# EAGLE schematic SpeedOfLightController (EAGLE 9.5.1)

## Sheet 1 of 5
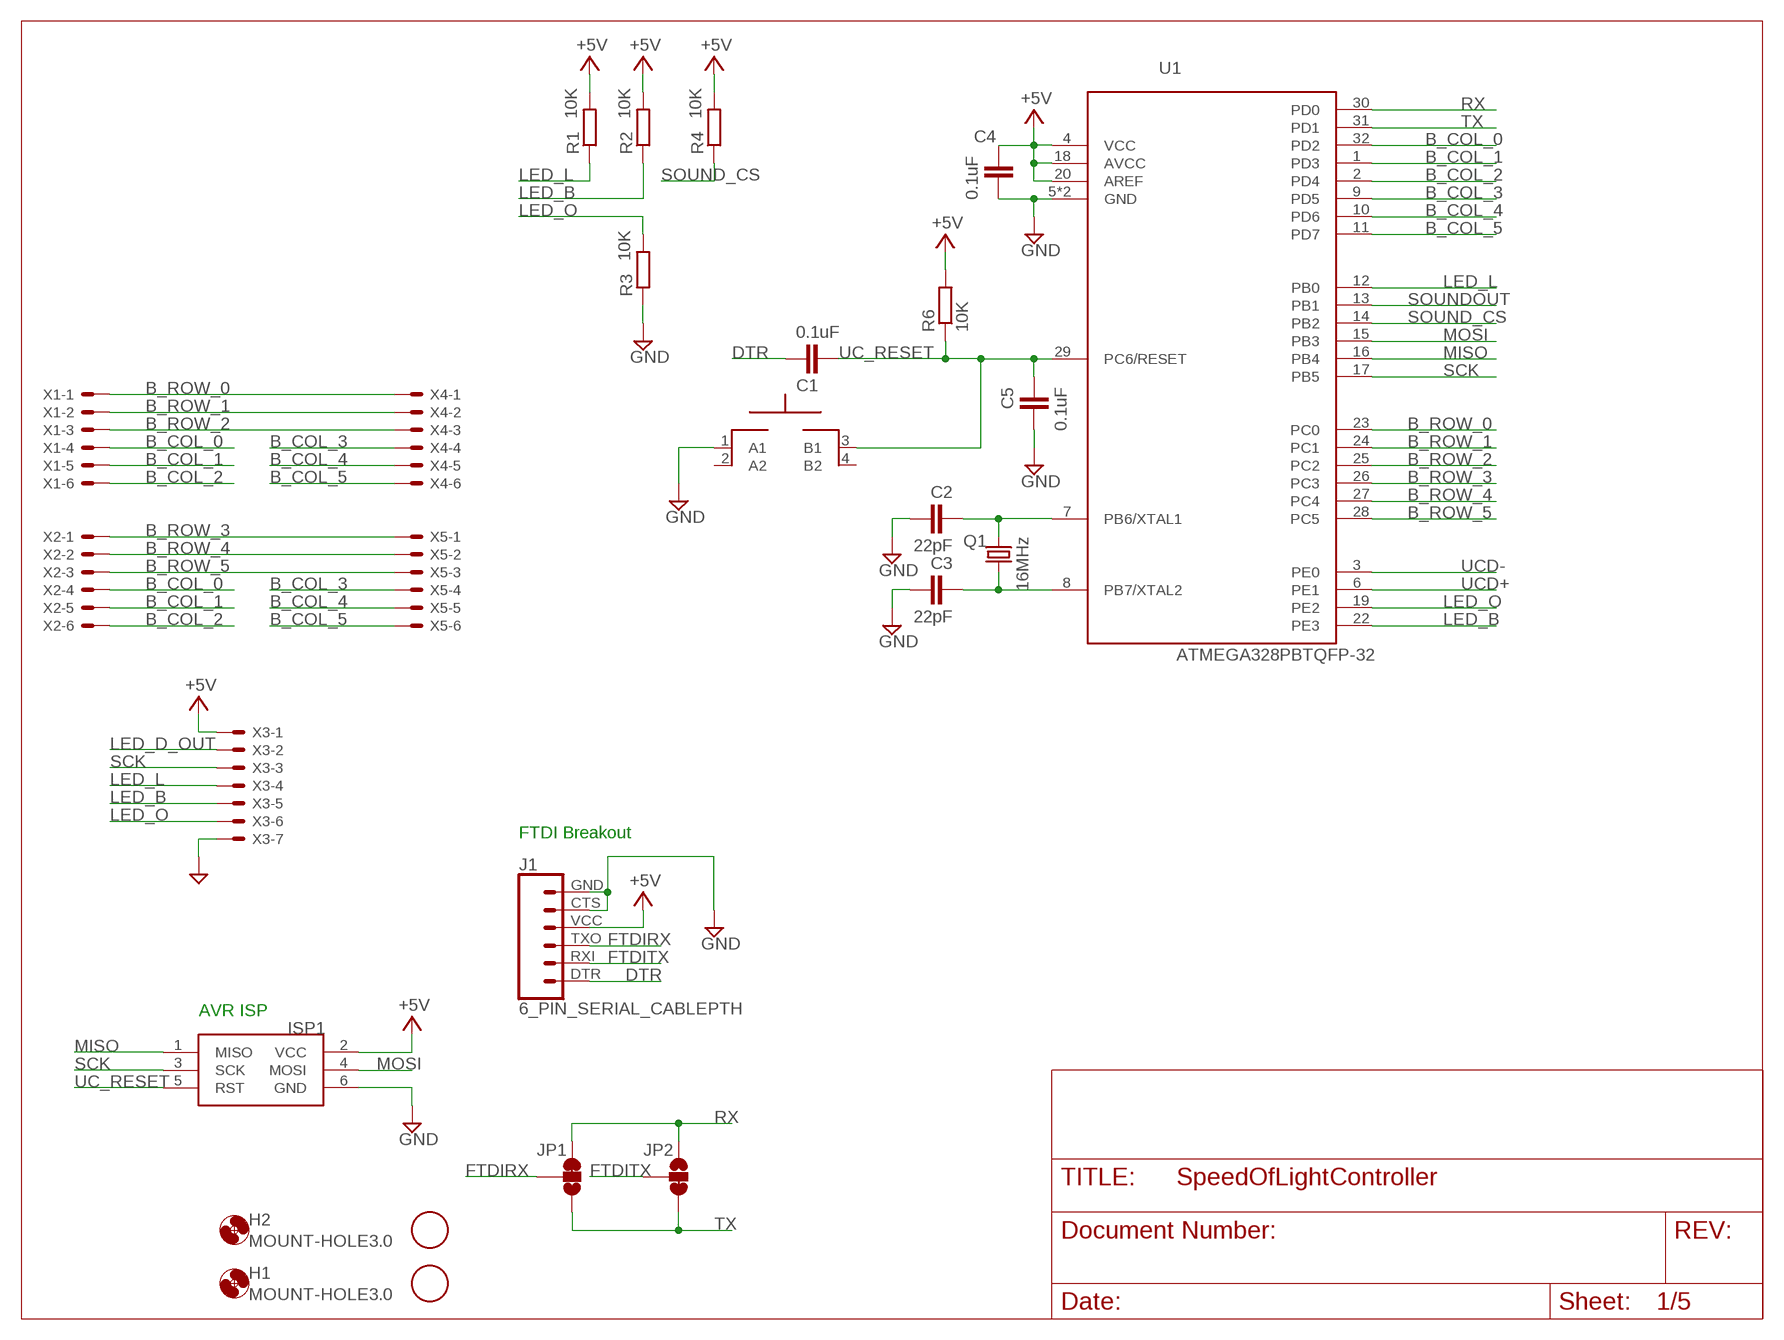
[diagram p0: schematic, sheet 1]

### Parts
C1  0.1uF  C-EUC0805  [C0805]
C2  22pF  C-EUC0805  [C0805]
C3  22pF  C-EUC0805  [C0805]
C4  0.1uF  C-EUC0805  [C0805]
C5  0.1uF  C-EUC0805  [C0805]
F1  FIDUCIAL  [FIDUCIAL_1MM]
F2  FIDUCIAL  [FIDUCIAL_1MM]
H1  MOUNT-HOLE3.0  [3,0]
H2  MOUNT-HOLE3.0  [3,0]
ISP1  AVRISP-6  [AVRISP]
J1  6_PIN_SERIAL_CABLEPTH  [FTDI_BASIC]
JP1  JUMPER-SMT_3_1-NC_TRACE_SILK  [SMT-JUMPER_3_1-NC_TRACE_SILK]
JP2  JUMPER-SMT_3_1-NC_TRACE_SILK  [SMT-JUMPER_3_1-NC_TRACE_SILK]
Q1  16MHz  CRYSTALHC49UP  [HC49UP]
R1  10K  R-EU_R0805  [R0805]
R2  10K  R-EU_R0805  [R0805]
R3  10K  R-EU_R0805  [R0805]
R4  10K  R-EU_R0805  [R0805]
R6  10K  R-EU_R0805  [R0805]
RESET  MOMENTARYBUTTON  [SPST_NO_SMD]
U1  ATMEGA328PBTQFP-32  [QFP80P900X900X120-32N]
X1  JST-XH-06-PIN-LONG-PAD  [JST-XH-06-PACKAGE-LONG-PAD]
X2  JST-XH-06-PIN-LONG-PAD  [JST-XH-06-PACKAGE-LONG-PAD]
X3  JST-XH-07-PIN-LONG-PAD  [JST-XH-07-PACKAGE-LONG-PAD]
X4  JST-XH-06-PIN-LONG-PAD  [JST-XH-06-PACKAGE-LONG-PAD]
X5  JST-XH-06-PIN-LONG-PAD  [JST-XH-06-PACKAGE-LONG-PAD]

### Nets
+5V: C4.2 ISP1.2(VCC) J1.VCC R1.2 R2.2 R4.2 R6.2 U1.4(VCC) U1.18(AVCC) U1.20(AREF) X3.1 ; also sheet 2,4,5
B_COL_0: U1.32(PD2) X1.4 X2.4
B_COL_1: U1.1(PD3) X1.5 X2.5
B_COL_2: U1.2(PD4) X1.6 X2.6
B_COL_3: U1.9(PD5) X4.4 X5.4
B_COL_4: U1.10(PD6) X4.5 X5.5
B_COL_5: U1.11(PD7) X4.6 X5.6
B_ROW_0: U1.23(PC0) X1.1 X4.1
B_ROW_1: U1.24(PC1) X1.2 X4.2
B_ROW_2: U1.25(PC2) X1.3 X4.3
B_ROW_3: U1.26(PC3) X2.1 X5.1
B_ROW_4: U1.27(PC4) X2.2 X5.2
B_ROW_5: U1.28(PC5) X2.3 X5.3
DTR: C1.2 J1.DTR
FTDIRX: J1.TXO JP1.2
FTDITX: J1.RXI JP2.2
GND: C2.1 C3.1 C4.1 C5.1 ISP1.6(GND) J1.CTS J1.GND R3.1 RESET.1(A1) U1.5(GND) U1.21(GND) X3.7 ; also sheet 2,3,4,5
LED_B: R2.1 U1.22(PE3) X3.5 ; also sheet 2
LED_D_OUT: X3.2 ; also sheet 2
LED_L: R1.1 U1.12(PB0) X3.4 ; also sheet 2
LED_O: R3.2 U1.19(PE2) X3.6 ; also sheet 2
MISO: ISP1.1(MISO) U1.16(PB4) ; also sheet 4
MOSI: ISP1.4(MOSI) U1.15(PB3) ; also sheet 2,4
N$17: C2.2 Q1.1 U1.7(PB6/XTAL1)
N$18: C3.2 Q1.2 U1.8(PB7/XTAL2)
RX: JP1.3 JP2.1 U1.30(PD0)
SCK: ISP1.3(SCK) U1.17(PB5) X3.3 ; also sheet 2,4
SOUND_CS: R4.1 U1.14(PB2) ; also sheet 4
SOUNDOUT: U1.13(PB1) ; also sheet 4
TX: JP1.1 JP2.3 U1.31(PD1)
UC_RESET: C1.1 C5.2 ISP1.5(RST) R6.1 RESET.3(B1) U1.29(PC6/RESET)
UCD+: U1.6(PE1) ; also sheet 5
UCD-: U1.3(PE0) ; also sheet 5
Unconnected: RESET.2(A2) RESET.4(B2)

### Notes on the sheet
- FTDI Breakout
- AVR ISP

## Sheet 2 of 5: ScoreBoard
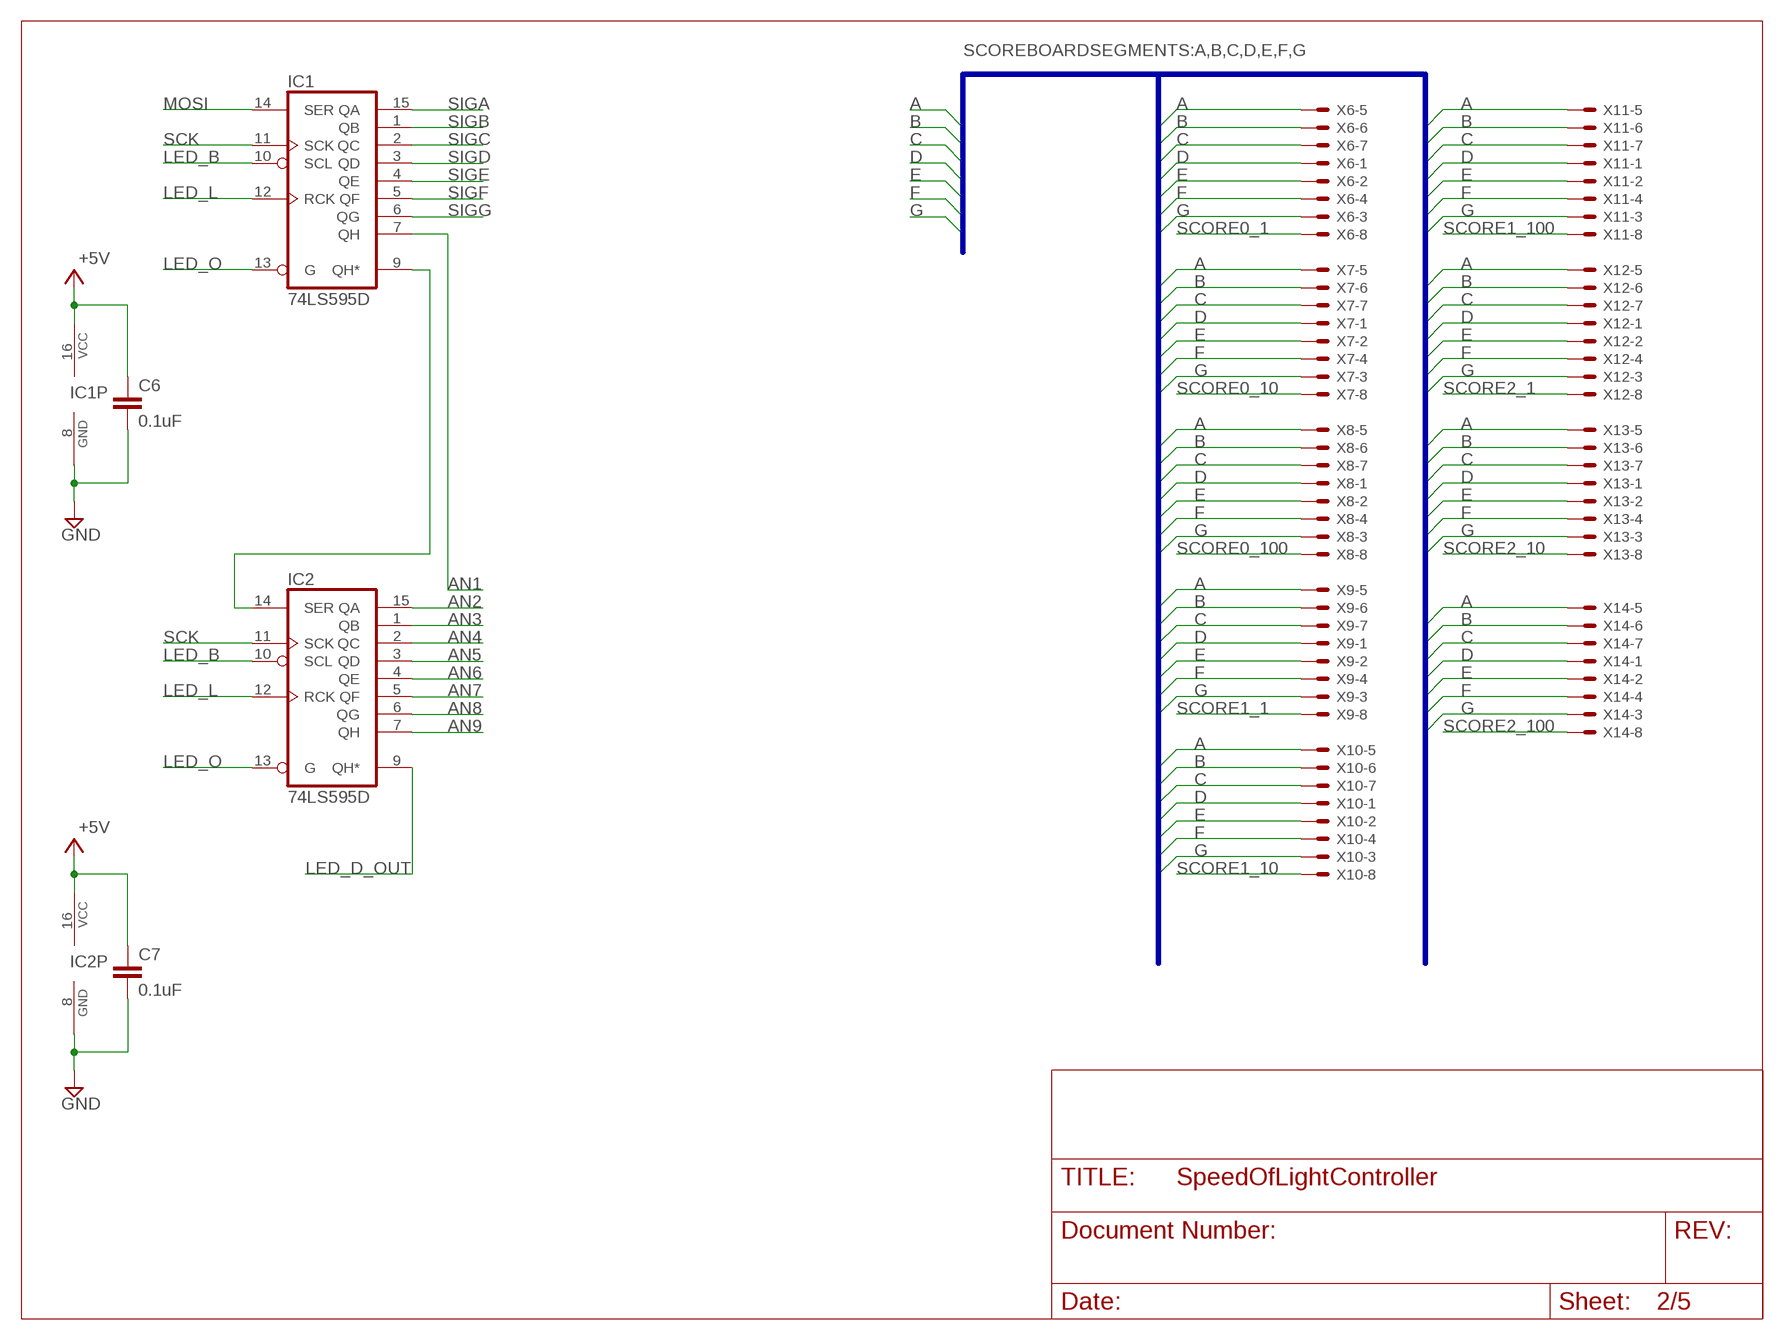
[diagram p1: schematic, sheet 2]

### Parts
C6  0.1uF  C-EUC0805  [C0805]
C7  0.1uF  C-EUC0805  [C0805]
IC1  74LS595D  [SO16]
IC2  74LS595D  [SO16]
X6  JST-XH-08-PIN-LONG-PAD  [JST-XH-08-PACKAGE-LONG-PAD]
X7  JST-XH-08-PIN-LONG-PAD  [JST-XH-08-PACKAGE-LONG-PAD]
X8  JST-XH-08-PIN-LONG-PAD  [JST-XH-08-PACKAGE-LONG-PAD]
X9  JST-XH-08-PIN-LONG-PAD  [JST-XH-08-PACKAGE-LONG-PAD]
X10  JST-XH-08-PIN-LONG-PAD  [JST-XH-08-PACKAGE-LONG-PAD]
X11  JST-XH-08-PIN-LONG-PAD  [JST-XH-08-PACKAGE-LONG-PAD]
X12  JST-XH-08-PIN-LONG-PAD  [JST-XH-08-PACKAGE-LONG-PAD]
X13  JST-XH-08-PIN-LONG-PAD  [JST-XH-08-PACKAGE-LONG-PAD]
X14  JST-XH-08-PIN-LONG-PAD  [JST-XH-08-PACKAGE-LONG-PAD]

### Nets
+5V: C6.1 C7.1 IC1.16(VCC) IC2.16(VCC) ; also sheet 1,4,5
A: X6.5 X7.5 X8.5 X9.5 X10.5 X11.5 X12.5 X13.5 X14.5 ; also sheet 3
AN1: IC1.7(QH) ; also sheet 3
AN2: IC2.15(QA) ; also sheet 3
AN3: IC2.1(QB) ; also sheet 3
AN4: IC2.2(QC) ; also sheet 3
AN5: IC2.3(QD) ; also sheet 3
AN6: IC2.4(QE) ; also sheet 3
AN7: IC2.5(QF) ; also sheet 3
AN8: IC2.6(QG) ; also sheet 3
AN9: IC2.7(QH) ; also sheet 3
B: X6.6 X7.6 X8.6 X9.6 X10.6 X11.6 X12.6 X13.6 X14.6 ; also sheet 3
C: X6.7 X7.7 X8.7 X9.7 X10.7 X11.7 X12.7 X13.7 X14.7 ; also sheet 3
D: X6.1 X7.1 X8.1 X9.1 X10.1 X11.1 X12.1 X13.1 X14.1 ; also sheet 3
E: X6.2 X7.2 X8.2 X9.2 X10.2 X11.2 X12.2 X13.2 X14.2 ; also sheet 3
F: X6.4 X7.4 X8.4 X9.4 X10.4 X11.4 X12.4 X13.4 X14.4 ; also sheet 3
G: X6.3 X7.3 X8.3 X9.3 X10.3 X11.3 X12.3 X13.3 X14.3 ; also sheet 3
GND: C6.2 C7.2 IC1.8(GND) IC2.8(GND) ; also sheet 1,3,4,5
LED_B: IC1.10(SCL) IC2.10(SCL) ; also sheet 1
LED_D_OUT: IC2.9(QH*) ; also sheet 1
LED_L: IC1.12(RCK) IC2.12(RCK) ; also sheet 1
LED_O: IC1.13(G) IC2.13(G) ; also sheet 1
MOSI: IC1.14(SER) ; also sheet 1,4
N$39: IC1.9(QH*) IC2.14(SER)
SCK: IC1.11(SCK) IC2.11(SCK) ; also sheet 1,4
SCORE0_1: X6.8 ; also sheet 3
SCORE0_10: X7.8 ; also sheet 3
SCORE0_100: X8.8 ; also sheet 3
SCORE1_1: X9.8 ; also sheet 3
SCORE1_10: X10.8 ; also sheet 3
SCORE1_100: X11.8 ; also sheet 3
SCORE2_1: X12.8 ; also sheet 3
SCORE2_10: X13.8 ; also sheet 3
SCORE2_100: X14.8 ; also sheet 3
SIGA: IC1.15(QA) ; also sheet 3
SIGB: IC1.1(QB) ; also sheet 3
SIGC: IC1.2(QC) ; also sheet 3
SIGD: IC1.3(QD) ; also sheet 3
SIGE: IC1.4(QE) ; also sheet 3
SIGF: IC1.5(QF) ; also sheet 3
SIGG: IC1.6(QG) ; also sheet 3

### Buses
SCOREBOARDSEGMENTS:A,B,C,D,E,F,G

## Sheet 3 of 5: Scoreboard switches
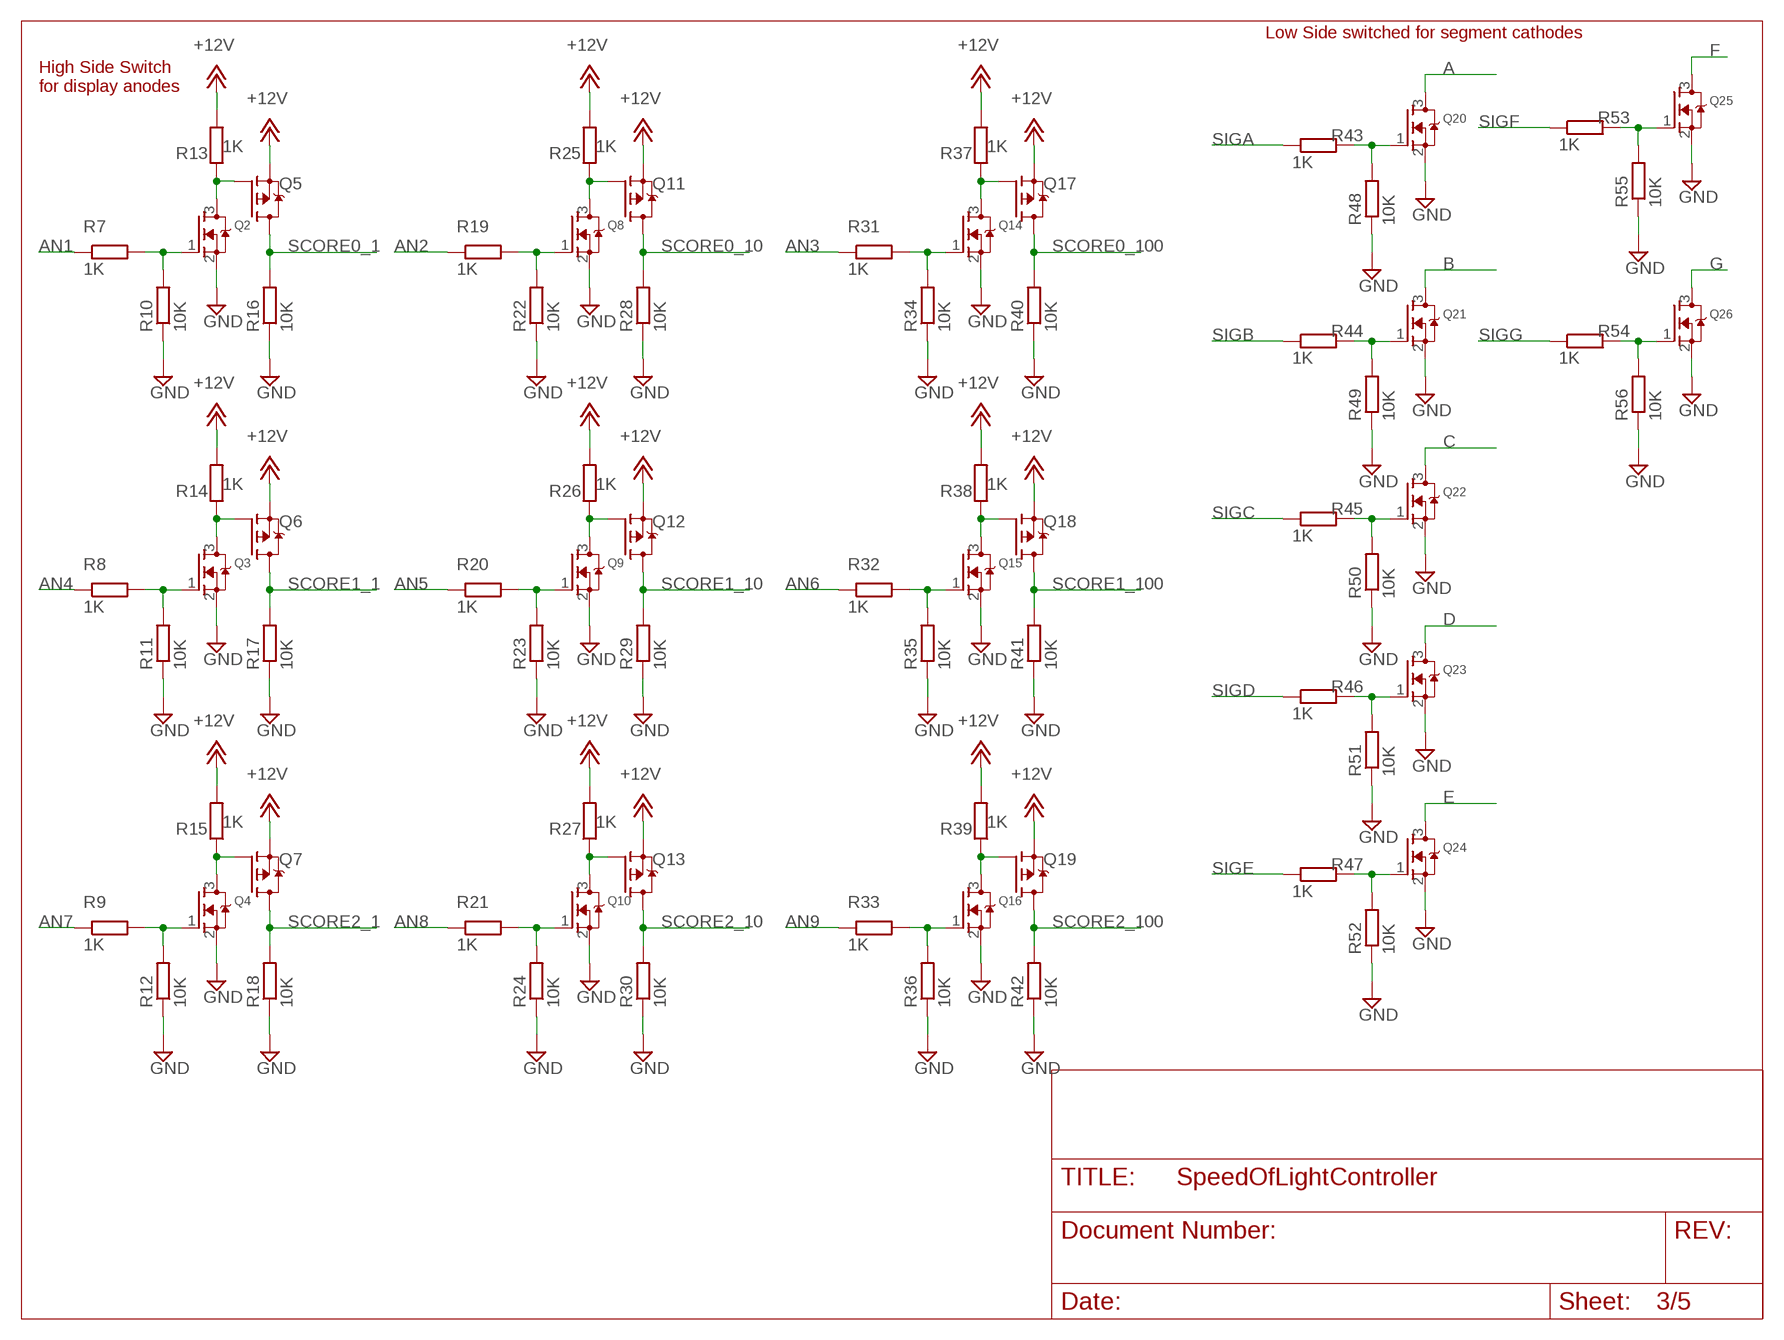
[diagram p2: schematic, sheet 3]

### Parts
Q2  AO3414SOT23  [SOT95P240X110-3N]
Q3  AO3414SOT23  [SOT95P240X110-3N]
Q4  AO3414SOT23  [SOT95P240X110-3N]
Q5  AO3415  [SOT95P240X110-3N]
Q6  AO3415  [SOT95P240X110-3N]
Q7  AO3415  [SOT95P240X110-3N]
Q8  AO3414SOT23  [SOT95P240X110-3N]
Q9  AO3414SOT23  [SOT95P240X110-3N]
Q10  AO3414SOT23  [SOT95P240X110-3N]
Q11  AO3415  [SOT95P240X110-3N]
Q12  AO3415  [SOT95P240X110-3N]
Q13  AO3415  [SOT95P240X110-3N]
Q14  AO3414SOT23  [SOT95P240X110-3N]
Q15  AO3414SOT23  [SOT95P240X110-3N]
Q16  AO3414SOT23  [SOT95P240X110-3N]
Q17  AO3415  [SOT95P240X110-3N]
Q18  AO3415  [SOT95P240X110-3N]
Q19  AO3415  [SOT95P240X110-3N]
Q20  AO3414SOT23  [SOT95P240X110-3N]
Q21  AO3414SOT23  [SOT95P240X110-3N]
Q22  AO3414SOT23  [SOT95P240X110-3N]
Q23  AO3414SOT23  [SOT95P240X110-3N]
Q24  AO3414SOT23  [SOT95P240X110-3N]
Q25  AO3414SOT23  [SOT95P240X110-3N]
Q26  AO3414SOT23  [SOT95P240X110-3N]
R7  1K  R-EU_R0805  [R0805]
R8  1K  R-EU_R0805  [R0805]
R9  1K  R-EU_R0805  [R0805]
R10  10K  R-EU_R0805  [R0805]
R11  10K  R-EU_R0805  [R0805]
R12  10K  R-EU_R0805  [R0805]
R13  1K  R-EU_R0805  [R0805]
R14  1K  R-EU_R0805  [R0805]
R15  1K  R-EU_R0805  [R0805]
R16  10K  R-EU_R0805  [R0805]
R17  10K  R-EU_R0805  [R0805]
R18  10K  R-EU_R0805  [R0805]
R19  1K  R-EU_R0805  [R0805]
R20  1K  R-EU_R0805  [R0805]
R21  1K  R-EU_R0805  [R0805]
R22  10K  R-EU_R0805  [R0805]
R23  10K  R-EU_R0805  [R0805]
R24  10K  R-EU_R0805  [R0805]
R25  1K  R-EU_R0805  [R0805]
R26  1K  R-EU_R0805  [R0805]
R27  1K  R-EU_R0805  [R0805]
R28  10K  R-EU_R0805  [R0805]
R29  10K  R-EU_R0805  [R0805]
R30  10K  R-EU_R0805  [R0805]
R31  1K  R-EU_R0805  [R0805]
R32  1K  R-EU_R0805  [R0805]
R33  1K  R-EU_R0805  [R0805]
R34  10K  R-EU_R0805  [R0805]
R35  10K  R-EU_R0805  [R0805]
R36  10K  R-EU_R0805  [R0805]
R37  1K  R-EU_R0805  [R0805]
R38  1K  R-EU_R0805  [R0805]
R39  1K  R-EU_R0805  [R0805]
R40  10K  R-EU_R0805  [R0805]
R41  10K  R-EU_R0805  [R0805]
R42  10K  R-EU_R0805  [R0805]
R43  1K  R-EU_R0805  [R0805]
R44  1K  R-EU_R0805  [R0805]
R45  1K  R-EU_R0805  [R0805]
R46  1K  R-EU_R0805  [R0805]
R47  1K  R-EU_R0805  [R0805]
R48  10K  R-EU_R0805  [R0805]
R49  10K  R-EU_R0805  [R0805]
R50  10K  R-EU_R0805  [R0805]
R51  10K  R-EU_R0805  [R0805]
R52  10K  R-EU_R0805  [R0805]
R53  1K  R-EU_R0805  [R0805]
R54  1K  R-EU_R0805  [R0805]
R55  10K  R-EU_R0805  [R0805]
R56  10K  R-EU_R0805  [R0805]

### Nets
+12V [power]: Q5.2(S) Q6.2(S) Q7.2(S) Q11.2(S) Q12.2(S) Q13.2(S) Q17.2(S) Q18.2(S) Q19.2(S) R13.2 R14.2 R15.2 R25.2 R26.2 R27.2 R37.2 R38.2 R39.2 ; also sheet 5
A: Q20.3(D) ; also sheet 2
AN1: R7.1 ; also sheet 2
AN2: R19.1 ; also sheet 2
AN3: R31.1 ; also sheet 2
AN4: R8.1 ; also sheet 2
AN5: R20.1 ; also sheet 2
AN6: R32.1 ; also sheet 2
AN7: R9.1 ; also sheet 2
AN8: R21.1 ; also sheet 2
AN9: R33.1 ; also sheet 2
B: Q21.3(D) ; also sheet 2
C: Q22.3(D) ; also sheet 2
D: Q23.3(D) ; also sheet 2
E: Q24.3(D) ; also sheet 2
F: Q25.3(D) ; also sheet 2
G: Q26.3(D) ; also sheet 2
GND: Q2.2(S) Q3.2(S) Q4.2(S) Q8.2(S) Q9.2(S) Q10.2(S) Q14.2(S) Q15.2(S) Q16.2(S) Q20.2(S) Q21.2(S) Q22.2(S) Q23.2(S) Q24.2(S) Q25.2(S) Q26.2(S) R10.1 R11.1 R12.1 R16.1 R17.1 R18.1 R22.1 R23.1 R24.1 R28.1 R29.1 R30.1 R34.1 R35.1 R36.1 R40.1 R41.1 R42.1 R48.1 R49.1 R50.1 R51.1 R52.1 R55.1 R56.1 ; also sheet 1,2,4,5
N$1: Q21.1(G) R44.2 R49.2
N$2: Q22.1(G) R45.2 R50.2
N$3: Q23.1(G) R46.2 R51.2
N$4: Q24.1(G) R47.2 R52.2
N$5: Q20.1(G) R43.2 R48.2
N$6: Q25.1(G) R53.2 R55.2
N$7: Q26.1(G) R54.2 R56.2
N$8: Q2.1(G) R7.2 R10.2
N$9: Q8.1(G) R19.2 R22.2
N$10: Q14.1(G) R31.2 R34.2
N$11: Q3.1(G) R8.2 R11.2
N$12: Q9.1(G) R20.2 R23.2
N$13: Q15.1(G) R32.2 R35.2
N$14: Q4.1(G) R9.2 R12.2
N$15: Q10.1(G) R21.2 R24.2
N$16: Q16.1(G) R33.2 R36.2
N$27: Q16.3(D) Q19.1(G) R39.1
N$28: Q10.3(D) Q13.1(G) R27.1
N$29: Q4.3(D) Q7.1(G) R15.1
N$30: Q3.3(D) Q6.1(G) R14.1
N$34: Q9.3(D) Q12.1(G) R26.1
N$35: Q15.3(D) Q18.1(G) R38.1
N$36: Q14.3(D) Q17.1(G) R37.1
N$37: Q8.3(D) Q11.1(G) R25.1
N$38: Q2.3(D) Q5.1(G) R13.1
SCORE0_1: Q5.3(D) R16.2 ; also sheet 2
SCORE0_10: Q11.3(D) R28.2 ; also sheet 2
SCORE0_100: Q17.3(D) R40.2 ; also sheet 2
SCORE1_1: Q6.3(D) R17.2 ; also sheet 2
SCORE1_10: Q12.3(D) R29.2 ; also sheet 2
SCORE1_100: Q18.3(D) R41.2 ; also sheet 2
SCORE2_1: Q7.3(D) R18.2 ; also sheet 2
SCORE2_10: Q13.3(D) R30.2 ; also sheet 2
SCORE2_100: Q19.3(D) R42.2 ; also sheet 2
SIGA: R43.1 ; also sheet 2
SIGB: R44.1 ; also sheet 2
SIGC: R45.1 ; also sheet 2
SIGD: R46.1 ; also sheet 2
SIGE: R47.1 ; also sheet 2
SIGF: R53.1 ; also sheet 2
SIGG: R54.1 ; also sheet 2

### Notes on the sheet
- Low Side switched for segment cathodes
- High Side Switch 
  for display anodes

## Sheet 4 of 5: Sound
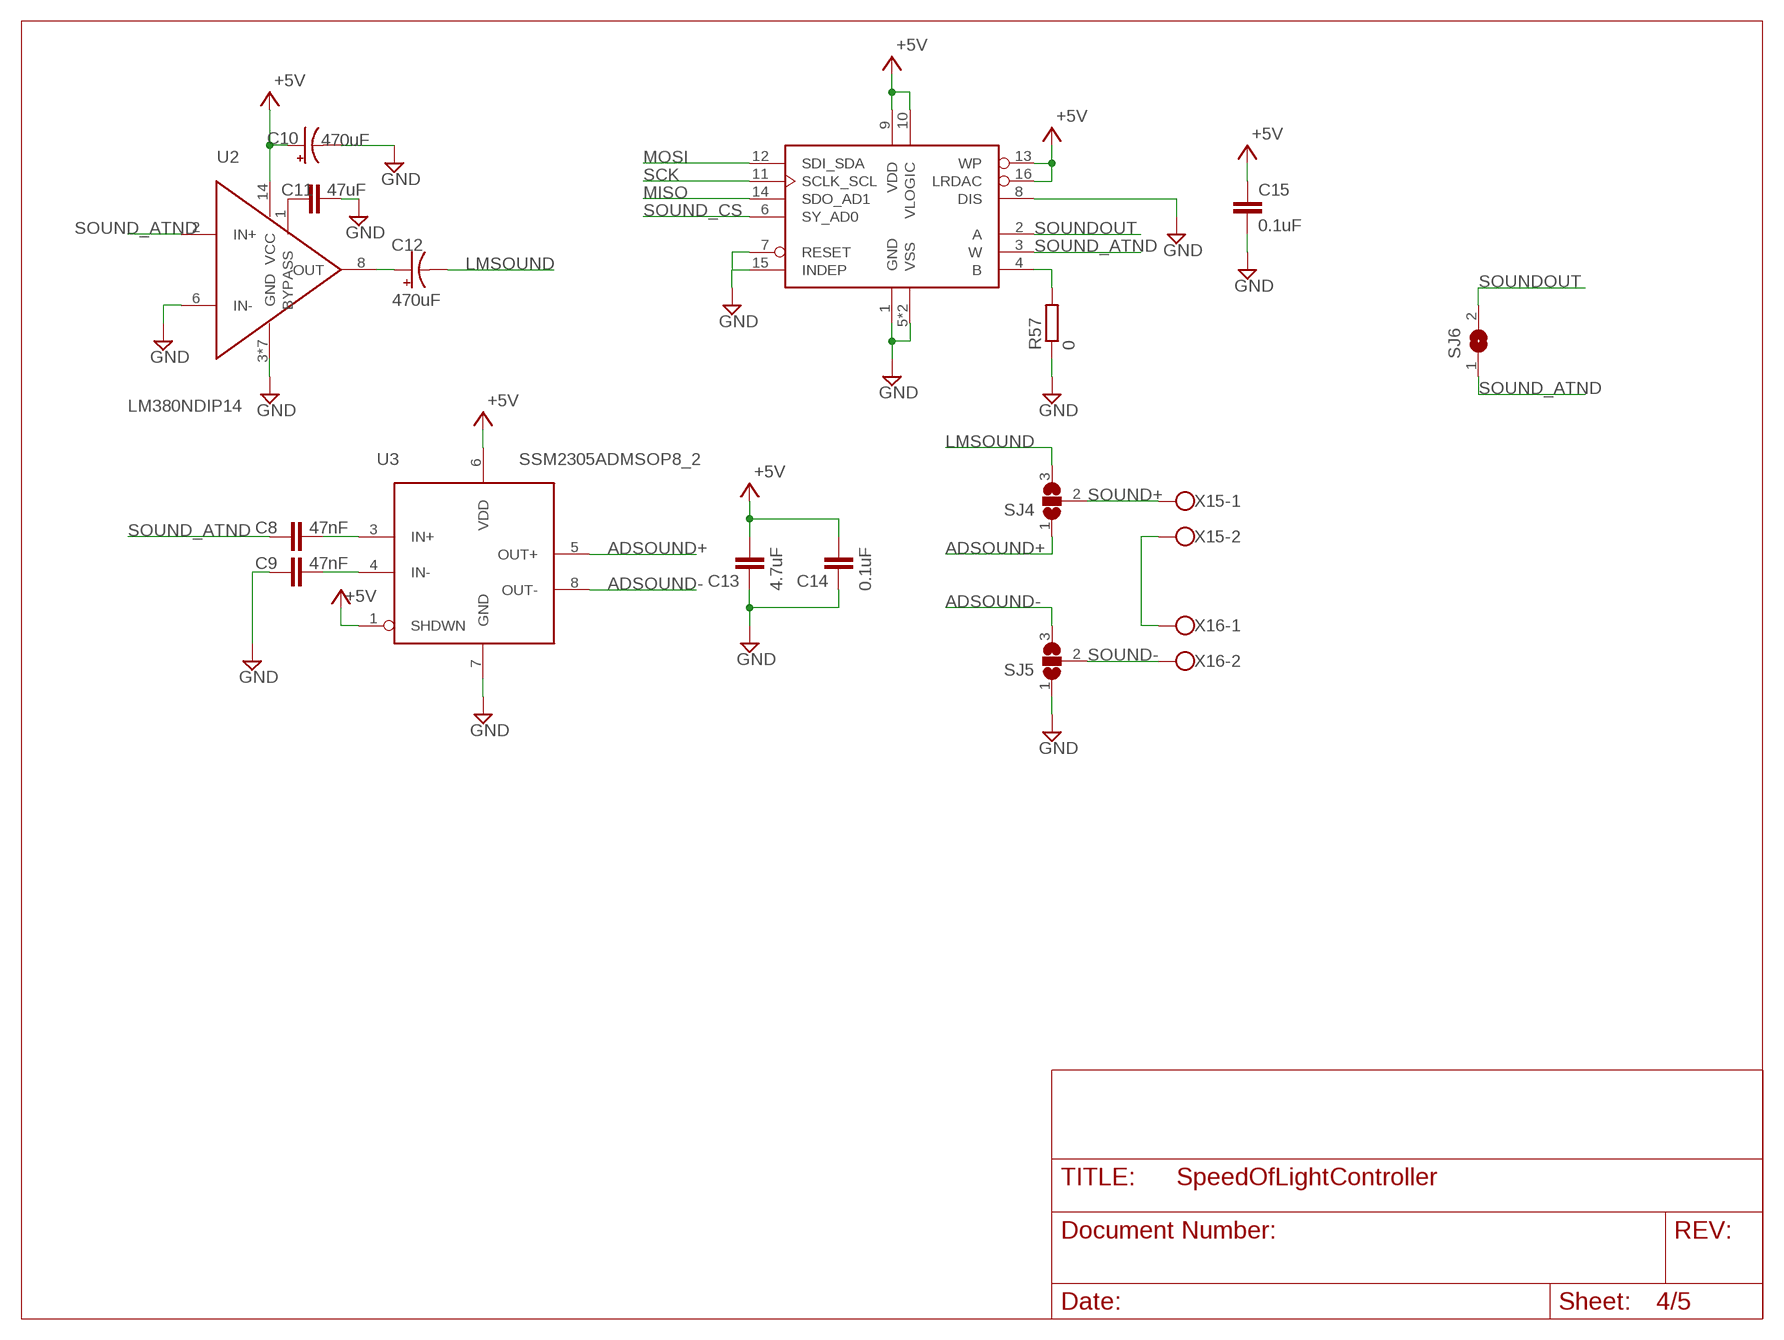
[diagram p3: schematic, sheet 4]

### Parts
C8  47nF  C-EUC0805  [C0805]
C9  47nF  C-EUC0805  [C0805]
C10  470uF  CPOL-US140CLH-0810  [140CLH-0810]
C11  47uF  C-EUC0805  [C0805]
C12  470uF  CPOL-US140CLH-0810  [140CLH-0810]
C13  4.7uF  C-EUC0805  [C0805]
C14  0.1uF  C-EUC0805  [C0805]
C15  0.1uF  C-EUC0805  [C0805]
R57  0  R-EU_R0805W  [R0805W]
SJ4  SJ2W  [SJ_2]
SJ5  SJ2W  [SJ_2]
SJ6  SJ  [SJ]
U2  LM380NDIP14  [DIP762W53P254L1969H508Q14B]
U3  SSM2305ADMSOP8_2  [SOP65P490X95-8N]
U4  AD5141ADLFCSP3  [QFN50P300X300X80-17T160N]
X15  1X02_5MM_SCREW  [W237-102]
X16  1X02_5MM_SCREW  [W237-102]

### Nets
+5V: C10.+ C13.2 C14.2 C15.1 U2.14(VCC) U3.1(SHDWN) U3.6(VDD) U4.9(VDD) U4.10(VLOGIC) U4.13(WP) U4.16(LRDAC) ; also sheet 1,2,5
ADSOUND+: SJ4.1 U3.5(OUT+)
ADSOUND-: SJ5.3 U3.8(OUT-)
GND: C9.1 C10.- C11.2 C13.1 C14.1 C15.2 R57.1 SJ5.1 U2.3(GND) U2.4(GND) U2.5(GND) U2.6(IN-) U2.7(GND) U2.10(GND) U2.11(GND) U2.12(GND) U3.7(GND) U4.1(GND) U4.5(VSS) U4.7(RESET) U4.8(DIS) U4.15(INDEP) U4.17(VSS) ; also sheet 1,2,3,5
LMSOUND: C12.- SJ4.3
MISO: U4.14(SDO_AD1) ; also sheet 1
MOSI: U4.12(SDI_SDA) ; also sheet 1,2
N$20: X15.2 X16.1
N$21: C12.+ U2.8(OUT)
N$22: C11.1 U2.1(BYPASS)
N$23: C9.2 U3.4(IN-)
N$24: C8.2 U3.3(IN+)
N$25: R57.2 U4.4(B)
SCK: U4.11(SCLK_SCL) ; also sheet 1,2
SOUND+: SJ4.2 X15.1
SOUND-: SJ5.2 X16.2
SOUND_ATND: C8.1 SJ6.1 U2.2(IN+) U4.3(W)
SOUND_CS: U4.6(SY_AD0) ; also sheet 1
SOUNDOUT: SJ6.2 U4.2(A) ; also sheet 1

## Sheet 5 of 5: POWER
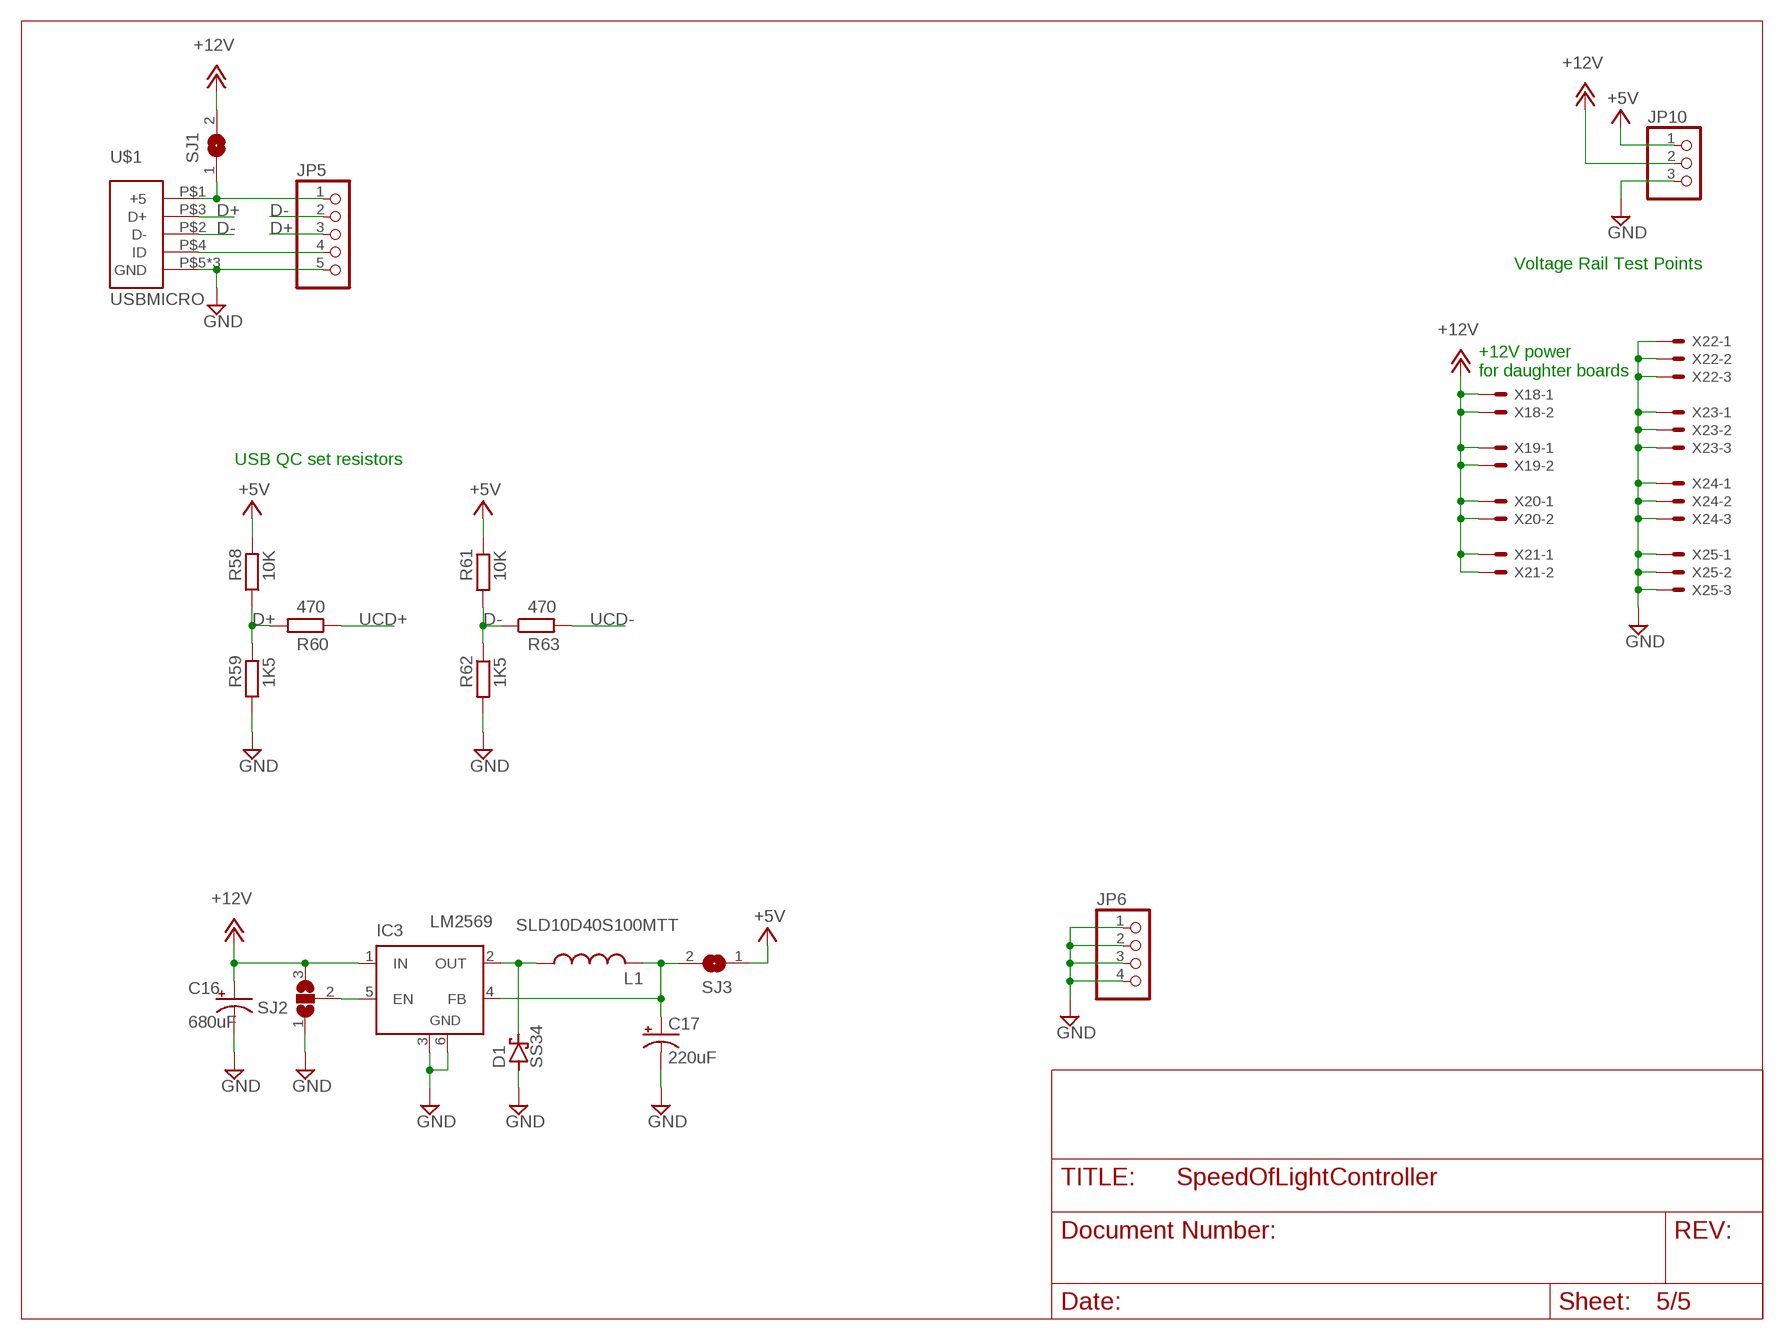
[diagram p4: schematic, sheet 5]

### Parts
C16  680uF  CPOL-US140CLH-0810  [140CLH-0810]
C17  220uF  CPOL-US140CLH-0810  [140CLH-0810]
D1  SS34  [SMA]
IC3  LM2596S  [TO263-5]
JP5  PINHD-1X5  [1X05]
JP6  PINHD-1X4  [1X04]
JP10  PINHD-1X3  [1X03]
L1  SLD10D40S100MTT  [SMD10.5X10.3]
R58  10K  R-EU_R0805  [R0805]
R59  1K5  R-EU_R0805  [R0805]
R60  470  R-EU_R0805  [R0805]
R61  10K  R-EU_R0805  [R0805]
R62  1K5  R-EU_R0805  [R0805]
R63  470  R-EU_R0805  [R0805]
SJ1  SJ  [SJ]
SJ2  SJ2WW  [SJ_2W]
SJ3  SJ  [SJ]
U$1  USBMICRO  [USBMICRO]
X18  JST-XH-02-PIN-LONG-PAD  [JST-XH-02-PACKAGE-LONG-PAD]
X19  JST-XH-02-PIN-LONG-PAD  [JST-XH-02-PACKAGE-LONG-PAD]
X20  JST-XH-02-PIN-LONG-PAD  [JST-XH-02-PACKAGE-LONG-PAD]
X21  JST-XH-02-PIN-LONG-PAD  [JST-XH-02-PACKAGE-LONG-PAD]
X22  JST-XH-03-PIN-LONG-PAD  [JST-XH-03-PACKAGE-LONG-PAD]
X23  JST-XH-03-PIN-LONG-PAD  [JST-XH-03-PACKAGE-LONG-PAD]
X24  JST-XH-03-PIN-LONG-PAD  [JST-XH-03-PACKAGE-LONG-PAD]
X25  JST-XH-03-PIN-LONG-PAD  [JST-XH-03-PACKAGE-LONG-PAD]

### Nets
+5V: JP10.1 R58.2 R61.1 SJ3.1 ; also sheet 1,2,4
+12V [power]: C16.+ IC3.1(IN) JP10.2 SJ1.2 SJ2.3 X18.1 X18.2 X19.1 X19.2 X20.1 X20.2 X21.1 X21.2 ; also sheet 3
D+: JP5.3 R58.1 R59.2 R60.2 U$1.P$3(D+)
D-: JP5.2 R61.2 R62.1 R63.1 U$1.P$2(D-)
GND: C16.- C17.- D1.A IC3.3(GND) IC3.6(GND) JP5.5 JP6.1 JP6.2 JP6.3 JP6.4 JP10.3 R59.1 R62.2 SJ2.1 U$1.P$5(GND) U$1.P$6(GND) U$1.P$8(GND) X22.1 X22.2 X22.3 X23.1 X23.2 X23.3 X24.1 X24.2 X24.3 X25.1 X25.2 X25.3 ; also sheet 1,2,3,4
N$19 [power]: JP5.1 SJ1.1 U$1.P$1(+5)
N$31: JP5.4 U$1.P$4(ID)
N$32: D1.C IC3.2(OUT) L1.P$1
N$40: IC3.5(EN) SJ2.2
N$41: C17.+ IC3.4(FB) L1.P$2 SJ3.2
UCD+: R60.1 ; also sheet 1
UCD-: R63.2 ; also sheet 1

### Notes on the sheet
- Voltage Rail Test Points
- +12V power
  for daughter boards
- USB QC set resistors
- LM2569

## Library data of the parts
C1-C9 C11 C13-C15 = rcl:C-EU: CAPACITOR, European symbol; SPICEPREFIX: C
C10 C12 C16 C17 = rcl:CPOL-US: POLARIZED CAPACITOR, American symbol; SPICEPREFIX: C
D1 = tmc:SS34
F1 F2 = ECE388:FIDUCIAL: For use by pick and place machines to calibrate the vision/machine, 1mm By microbuilder.eu
H1 H2 = holes:MOUNT-HOLE: MOUNTING HOLE with drill center marker
IC1 IC2 = 74xx-us:74*595: 8-bit SHIFT REGISTER, output latch
IC3 = linear:LM2596S: STEP-DOWN VOLTAGE REGULATOR
ISP1 = ECE388:AVRISP: AVR ISP HEADER Standard 6 pin header for AVR programming
J1 = SparkFun-Connectors:6_PIN_SERIAL_CABLE: 6-pin header connection for use with the "FTDI BASIC" pinout - CABLE SIDE. Also known as "Arduino Serial Program Header". This is used on a design to provide a 6-pin connection point for serial communication usually from a USB cable (D+/D-) to these headers (RX/TX). It also has the remaining pins necessary for programming in the Arduino evironment (DTR, GND, and sometimes VCC). Note, this device has "CABLE" in the name. It is intended to be used on a design that usually lives on the end of your USB cable and prvides the converter chip (FTDI232 or FTDI231x) to commnicate serial RX/TX. The "sister" device, named "TARGET" is inteneded to be used on a design that contains a target micro-controller that you wish to program. You can populate with some of these: Female Headers <https://www.sparkfun.com/products/115> (PRT-00115) For reference (or to suit your programming needs) check out these designs: SparkFun FTDI Basic Breakout - 5V <https://www.sparkfun.com/products/9716> (DEV-09716) SparkFun FTDI Basic Breakout - 3.3V <https://www.sparkfun.com/products/9873> (DEV-09873) SparkFun FTDI SmartBasic <https://www.sparkfun.com/products/12935> (DEV-12935) SparkFun Beefy 3 - FTDI Basic Breakout <https://www.sparkfun.com/products/13746> (DEV-13746)
JP1 JP2 = SparkFun-Jumpers:JUMPER-SMT_3_1-NC_TRACE: Normally closed trace jumper (1 of 2 connections) This jumper has a trace between two pads so it's normally closed (NC). The other connection is normally open (NO). Use a razor knife to open the connection. For best results follow the IPC guidelines for cutting traces: Cutout at least 0.063 mm (0.005 in). Remove all loose material to clean up the cut area. Seal the cut with an approved epoxy. Reapply solder to reclose the connection, or to close the NO connection.
JP5 = pinhead:PINHD-1X5: PIN HEADER
JP6 = pinhead:PINHD-1X4: PIN HEADER
JP10 = pinhead:PINHD-1X3: PIN HEADER
L1 = tmc:SLD10D40S100MTT
Q1 = crystal:CRYSTAL: CRYSTAL; OC_FARNELL: unknown; OC_NEWARK: unknown
Q2-Q4 Q8-Q10 Q14-Q16 Q20-Q26 = tmc:AO3414
Q5-Q7 Q11-Q13 Q17-Q19 = tmc:AO3415
R1-R4 R6-R63 = rcl:R-EU_: RESISTOR, European symbol; SPICEPREFIX: R
RESET = ECE388:MOMENTARYBUTTON
SJ1 SJ3 SJ6 = ECE388:SJ: SMD solder JUMPER
SJ2 SJ4 SJ5 = jumper:SJ2W: SMD solder JUMPER
U1 = tmc:ATMEGA328PB
U2 = tmc:LM380N
U3 = tmc:SSM2305
U4 = tmc:AD5141
U$1 = tmc:USBMICRO
X1 X2 X4 X5 = Rembrandt Electronics - JST XH Connectors v1-0:JST-XH-06-PIN: JST XH Connector 2 Pin Wire to board connector. Pitch: 2,54 mm, (0.100") Number of pins: 6 Created by Rembrandt Electronics www.rembrandtelectronics.com
X3 = Rembrandt Electronics - JST XH Connectors v1-0:JST-XH-07-PIN: JST XH Connector 2 Pin Wire to board connector. Pitch: 2,54 mm, (0.100") Number of pins: 7 Created by Rembrandt Electronics www.rembrandtelectronics.com
X6-X14 = Rembrandt Electronics - JST XH Connectors v1-0:JST-XH-08-PIN: JST XH Connector 2 Pin Wire to board connector. Pitch: 2,54 mm, (0.100") Number of pins: 8 Created by Rembrandt Electronics www.rembrandtelectronics.com
X15 X16 = ECE388:1X02_5MM_SCREW: WAGO SCREW CLAMP; MPN: 237-102; OC_FARNELL: unknown; OC_NEWARK: 70K9898
X18-X21 = Rembrandt Electronics - JST XH Connectors v1-0:JST-XH-02-PIN: JST XH Connector 2 Pin Wire to board connector. Pitch: 2,54 mm, (0.100") Number of pins: 2 Created by Rembrandt Electronics www.rembrandtelectronics.com
X22-X25 = Rembrandt Electronics - JST XH Connectors v1-0:JST-XH-03-PIN: JST XH Connector 2 Pin Wire to board connector. Pitch: 2,54 mm, (0.100") Number of pins: 3 Created by Rembrandt Electronics www.rembrandtelectronics.com

## Net classes
0 default: width 0.203 mm, drill 0.381 mm, clearance 0.203 mm
1 power: width 0.254 mm, drill 0.381 mm, clearance 0.254 mm